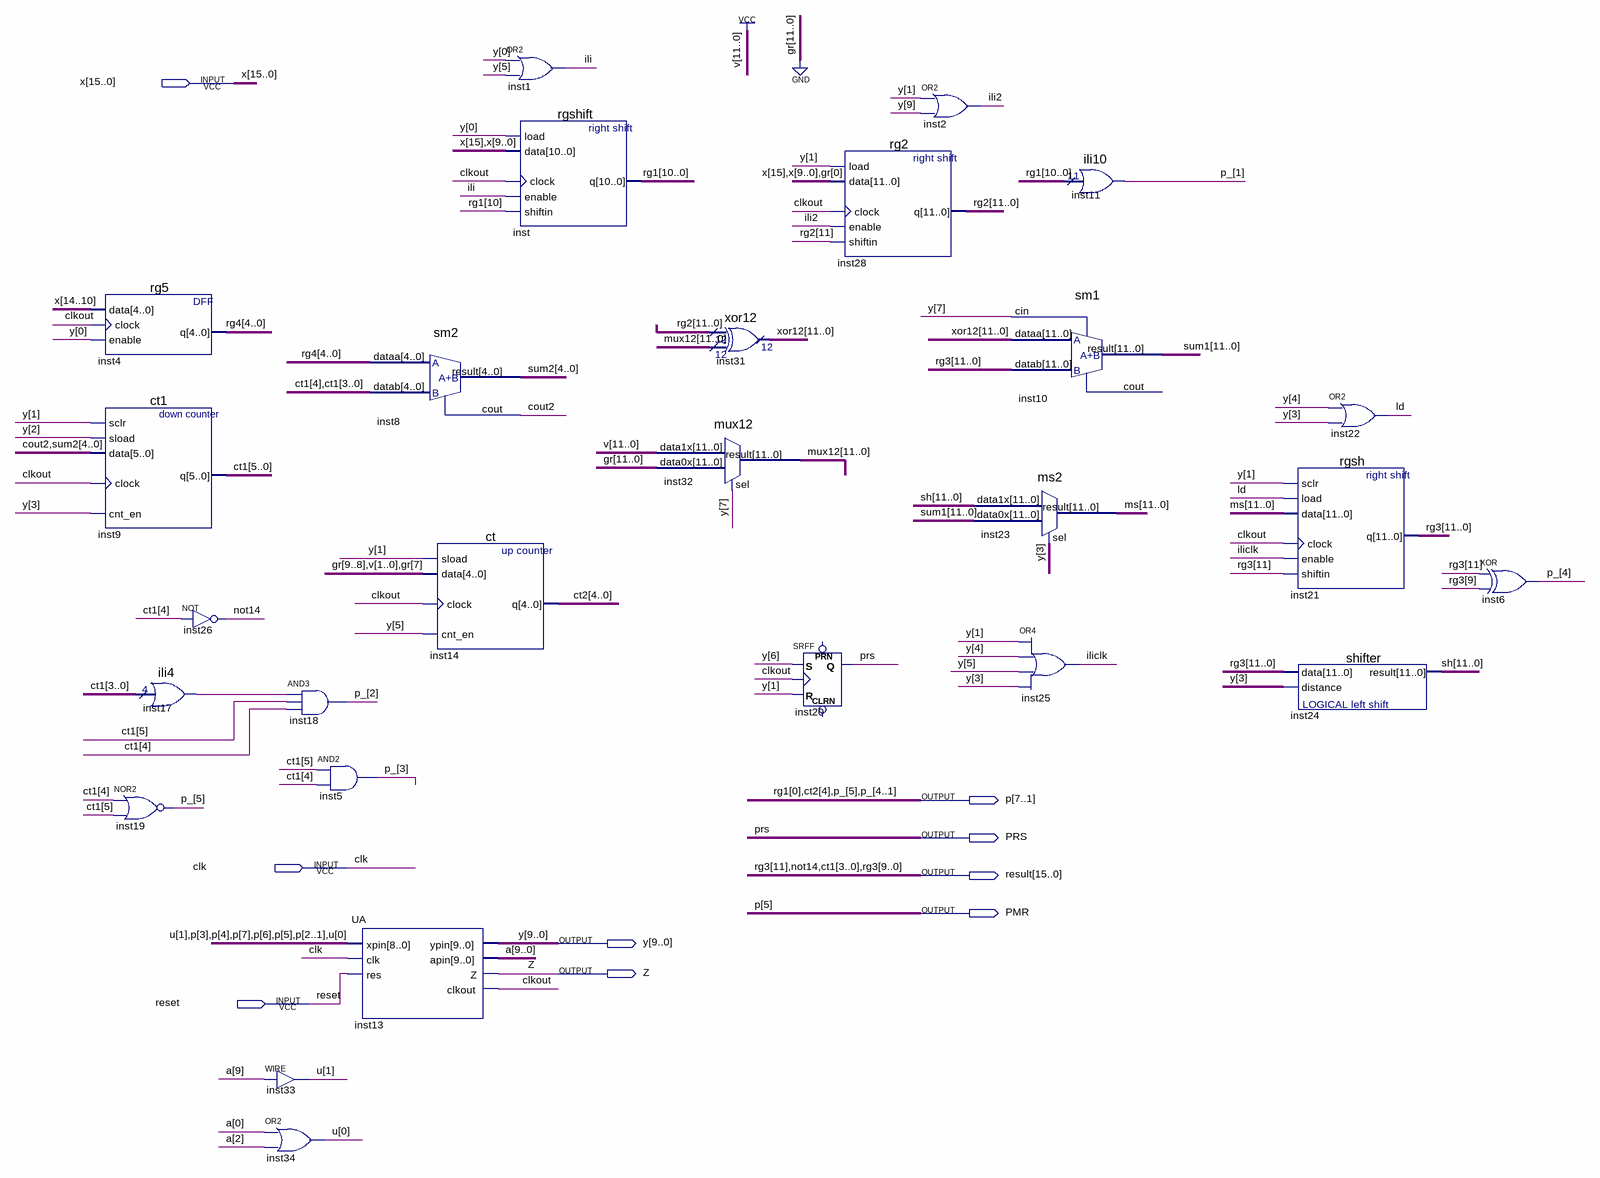
[diagram p0: schematic sheet]
// Quartus schematic FirstProgramm.bdf as structural Verilog: 27 symbols, 9 pins
module FirstProgramm (
  input  [15:0] x,
  input  clk,
  input  reset,
  output [7:1] p,
  output PRS,
  output [15:0] result,
  output PMR,
  output [9:0] y,
  output Z
);

  wire clkout, cout2, ili, ili2, iliclk, inst17_result, ld;
  wire [1:0] u;
  wire [3:0] ct2;
  wire [4:0] rg4, sum2;
  wire [5:4] ct1;
  wire [9:0] a;
  wire [10:1] rg1;
  wire [10:10] rg3;
  wire [11:0] ms, mux12, rg2, sh, sum1, xor12;

  rg5 inst4 (.data(x[14:10]), .clock(clkout), .enable(y[0]), .q(rg4));
  ct1 inst9 (.sclr(y[1]), .sload(y[2]), .data({cout2, sum2}), .clock(clkout), .cnt_en(y[3]), .q({ct1, result[13:10]}));
  ili4 inst17 (.data(result[13:10]), .result(inst17_result));
  nor inst19 (p[5], ct1[4], ct1[5]);
  not inst26 (result[14], ct1[4]);
  and inst18 (p[2], inst17_result, ct1[5], ct1[4]);
  and inst5 (p[3], ct1[5], ct1[4]);
  assign u[1] = a[9];  // WIRE inst33
  or inst34 (u[0], a[0], a[2]);
  sm2 inst8 (.dataa(rg4), .datab({ct1[4], result[13:10]}), .result(sum2), .cout(cout2));
  UA inst13 (
    .xpin({u[1], p[3], p[4], p[7:5], p[2:1], u[0]}), .clk(clk), .res(reset), .ypin(y), .apin(a), .Z(Z),
    .clkout(clkout));
  ct inst14 (.sload(y[1]), .data(5'b00110), .clock(clkout), .cnt_en(y[5]), .q({p[6], ct2}));
  or inst1 (ili, y[0], y[5]);
  rgshift inst (.load(y[0]), .data({x[15], x[9:0]}), .clock(clkout), .enable(ili), .shiftin(rg1[10]), .q({rg1, p[7]}));
  mux12 inst32 (.data1x({12{1'b1}}), .data0x({12{1'b0}}), .sel(y[7]), .result(mux12));
  xor12 inst31 (.data0x(rg2), .data1x(mux12), .result(xor12));
  SRFF inst20 (.S(y[6]), .R(y[1]), .CLK(clkout), .Q(PRS));  // open: PRN, CLRN
  rg2 inst28 (.load(y[1]), .data({x[15], x[9:0], 1'b0}), .clock(clkout), .enable(ili2), .shiftin(rg2[11]), .q(rg2));
  or inst2 (ili2, y[1], y[9]);
  ms2 inst23 (.data1x(sh), .data0x(sum1), .sel(y[3]), .result(ms));
  sm1 inst10 (.dataa(xor12), .datab({result[15], rg3[10], result[9:0]}), .cin(y[7]), .result(sum1));  // open: cout
  or inst25 (iliclk, y[1], y[4], y[5], y[3]);
  ili10 inst11 (.data({rg1, p[7]}), .result(p[1]));
  rgsh inst21 (
    .sclr(y[1]), .load(ld), .data(ms), .clock(clkout), .enable(iliclk), .shiftin(result[15]),
    .q({result[15], rg3[10], result[9:0]}));
  shifter inst24 (.data({result[15], rg3[10], result[9:0]}), .distance(y[3]), .result(sh));
  or inst22 (ld, y[4], y[3]);
  xor inst6 (p[4], result[15], result[9]);

  assign PMR = p[5];

  // Other names for the same wires on the sheet: ct1[3:0] = result[13:10]; ct2[4] = p[6]; not14 = result[14];
  //   p_[5:1] = p[5:1]; rg1[0] = p[7]; rg3 (some bits) = {result[15], result[9:0]}
endmodule
